# Altium schematic sheet TUDSSL_condenar__Hardware_PCBs_Mainboard_Board_TUD-V2-EnergyHarvestingConsole_TUD-EnergyHarvestingConsole_1__4_Debugging.schdoc
size 497 x 243 mm; Name: A_A4; Symbol: A_A4; Device: A_A4; @Project Name: TUD-EnergyHarvestingConsole_2022-08-29_17-01-09; REV: 1.0; Date: 2022-07-29; Sheet: 1/1; Draw By: Alejandro Cabrerizo; Convert to PCB: yes; Add into BOM: yes
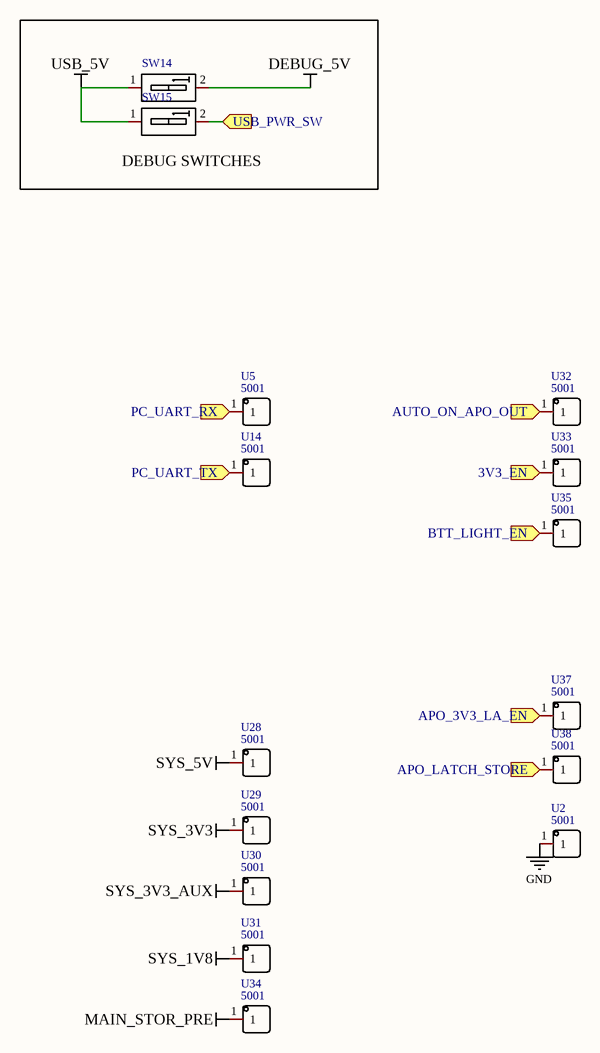
[diagram p0: TUDSSL_condenar__Hardware_PCBs_Mainboard_Board_TUD-V2-EnergyHarvestingConsole_TUD-EnergyHarvestingConsole_1__4_Debugging.schdoc]

## Parts
SW14  DSIC01LSGET  [SW-SMD_DSIC01LSGET]  (value not drawn)
SW15  DSIC01LSGET  [SW-SMD_DSIC01LSGET]  (value not drawn)
U2  5001  [TEST-TH_BD2.54-P1.39]
U5  5001  [TEST-TH_BD2.54-P1.39]
U14  5001  [TEST-TH_BD2.54-P1.39]
U28  5001  [TEST-TH_BD2.54-P1.39]
U29  5001  [TEST-TH_BD2.54-P1.39]
U30  5001  [TEST-TH_BD2.54-P1.39]
U31  5001  [TEST-TH_BD2.54-P1.39]
U32  5001  [TEST-TH_BD2.54-P1.39]
U33  5001  [TEST-TH_BD2.54-P1.39]
U34  5001  [TEST-TH_BD2.54-P1.39]
U35  5001  [TEST-TH_BD2.54-P1.39]
U37  5001  [TEST-TH_BD2.54-P1.39]
U38  5001  [TEST-TH_BD2.54-P1.39]

## Blocks framed on the sheet
DEBUG SWITCHES: SW14 SW15

## Ports
3V3_EN (in), APO_3V3_LA_EN (in), APO_LATCH_STORE (in), AUTO_ON_APO_OUT (in), BTT_LIGHT_EN (in), PC_UART_RX (in), PC_UART_TX (in), USB_PWR_SW (in)

## Nets
DEBUG_5V: SW14.2(A2)
GND: U2.1
MAIN_STOR_PRE: U34.1
SYS_1V8: U31.1
SYS_3V3: U29.1
SYS_3V3_AUX: U30.1
SYS_5V: U28.1
USB_5V: SW14.1(A1) SW15.1(A1)
3V3_EN: U33.1 ; port 3V3_EN
APO_3V3_LA_EN: U37.1 ; port APO_3V3_LA_EN
APO_LATCH_STORE: U38.1 ; port APO_LATCH_STORE
AUTO_ON_APO_OUT: U32.1 ; port AUTO_ON_APO_OUT
BTT_LIGHT_EN: U35.1 ; port BTT_LIGHT_EN
PC_UART_RX: U5.1 ; port PC_UART_RX
PC_UART_TX: U14.1 ; port PC_UART_TX
USB_PWR_SW: SW15.2(A2) ; port USB_PWR_SW

## Notes on the sheet
- 1
- 2
- 3
- 4
- 5
- A
- B
- C
- D
- TITLE:
- TUD-EnergyHarvestingConsole_2022-08-29_17-01-09
- REV:
- 1.0
- Date:
- Company:
- 2022-07-29
- Drawn By:
- Alejandro Cabrerizo
- Sheet:
- 1/1

## Library data of the parts
SW14 SW15 = DSIC01LSGET: Type:平拨，凸起式 Circuit:SPST Number of Positions:1 Lead Pitch:2.54mm Color:Black; Manufacturer: YE; Add into BOM: yes; Circuit: SPST; Number of Positions: 1; Name: DSIC01LSGET; Symbol: DSIC01LSGET; Device: DSIC01LSGET; LCSC Part Name: 2.54mm 1位高推 拨码开关; Supplier Part: C54948; Manufacturer Part: DSIC01LSGET; Supplier Footprint: SMD,2.5x6mm; JLCPCB Part Class: Extended Part; Datasheet: https://atta.szlcsc.com/upload/public/pdf/source/20150928/1457707425459.pdf; Supplier: LCSC; Convert to PCB: yes; Type: 平拨，凸起式; Lead Pitch: 2.54mm; Color: Black
U2 U5 U14 U28-U35 U37 U38 = 5001: Manufacturer: Keystone; Convert to PCB: yes; Name: 5001; Symbol: 5001; Device: 5001; Supplier: LCSC; Supplier Part: C238122; Manufacturer Part: 5001; JLCPCB Part Class: Extended Part; Add into BOM: yes; Origin Footprint: TEST-TH_BD2.54-P1.39